# Altium schematic sheet DOAN2.SchDoc
size A3; SheetNumber: 1; SheetTotal: 2
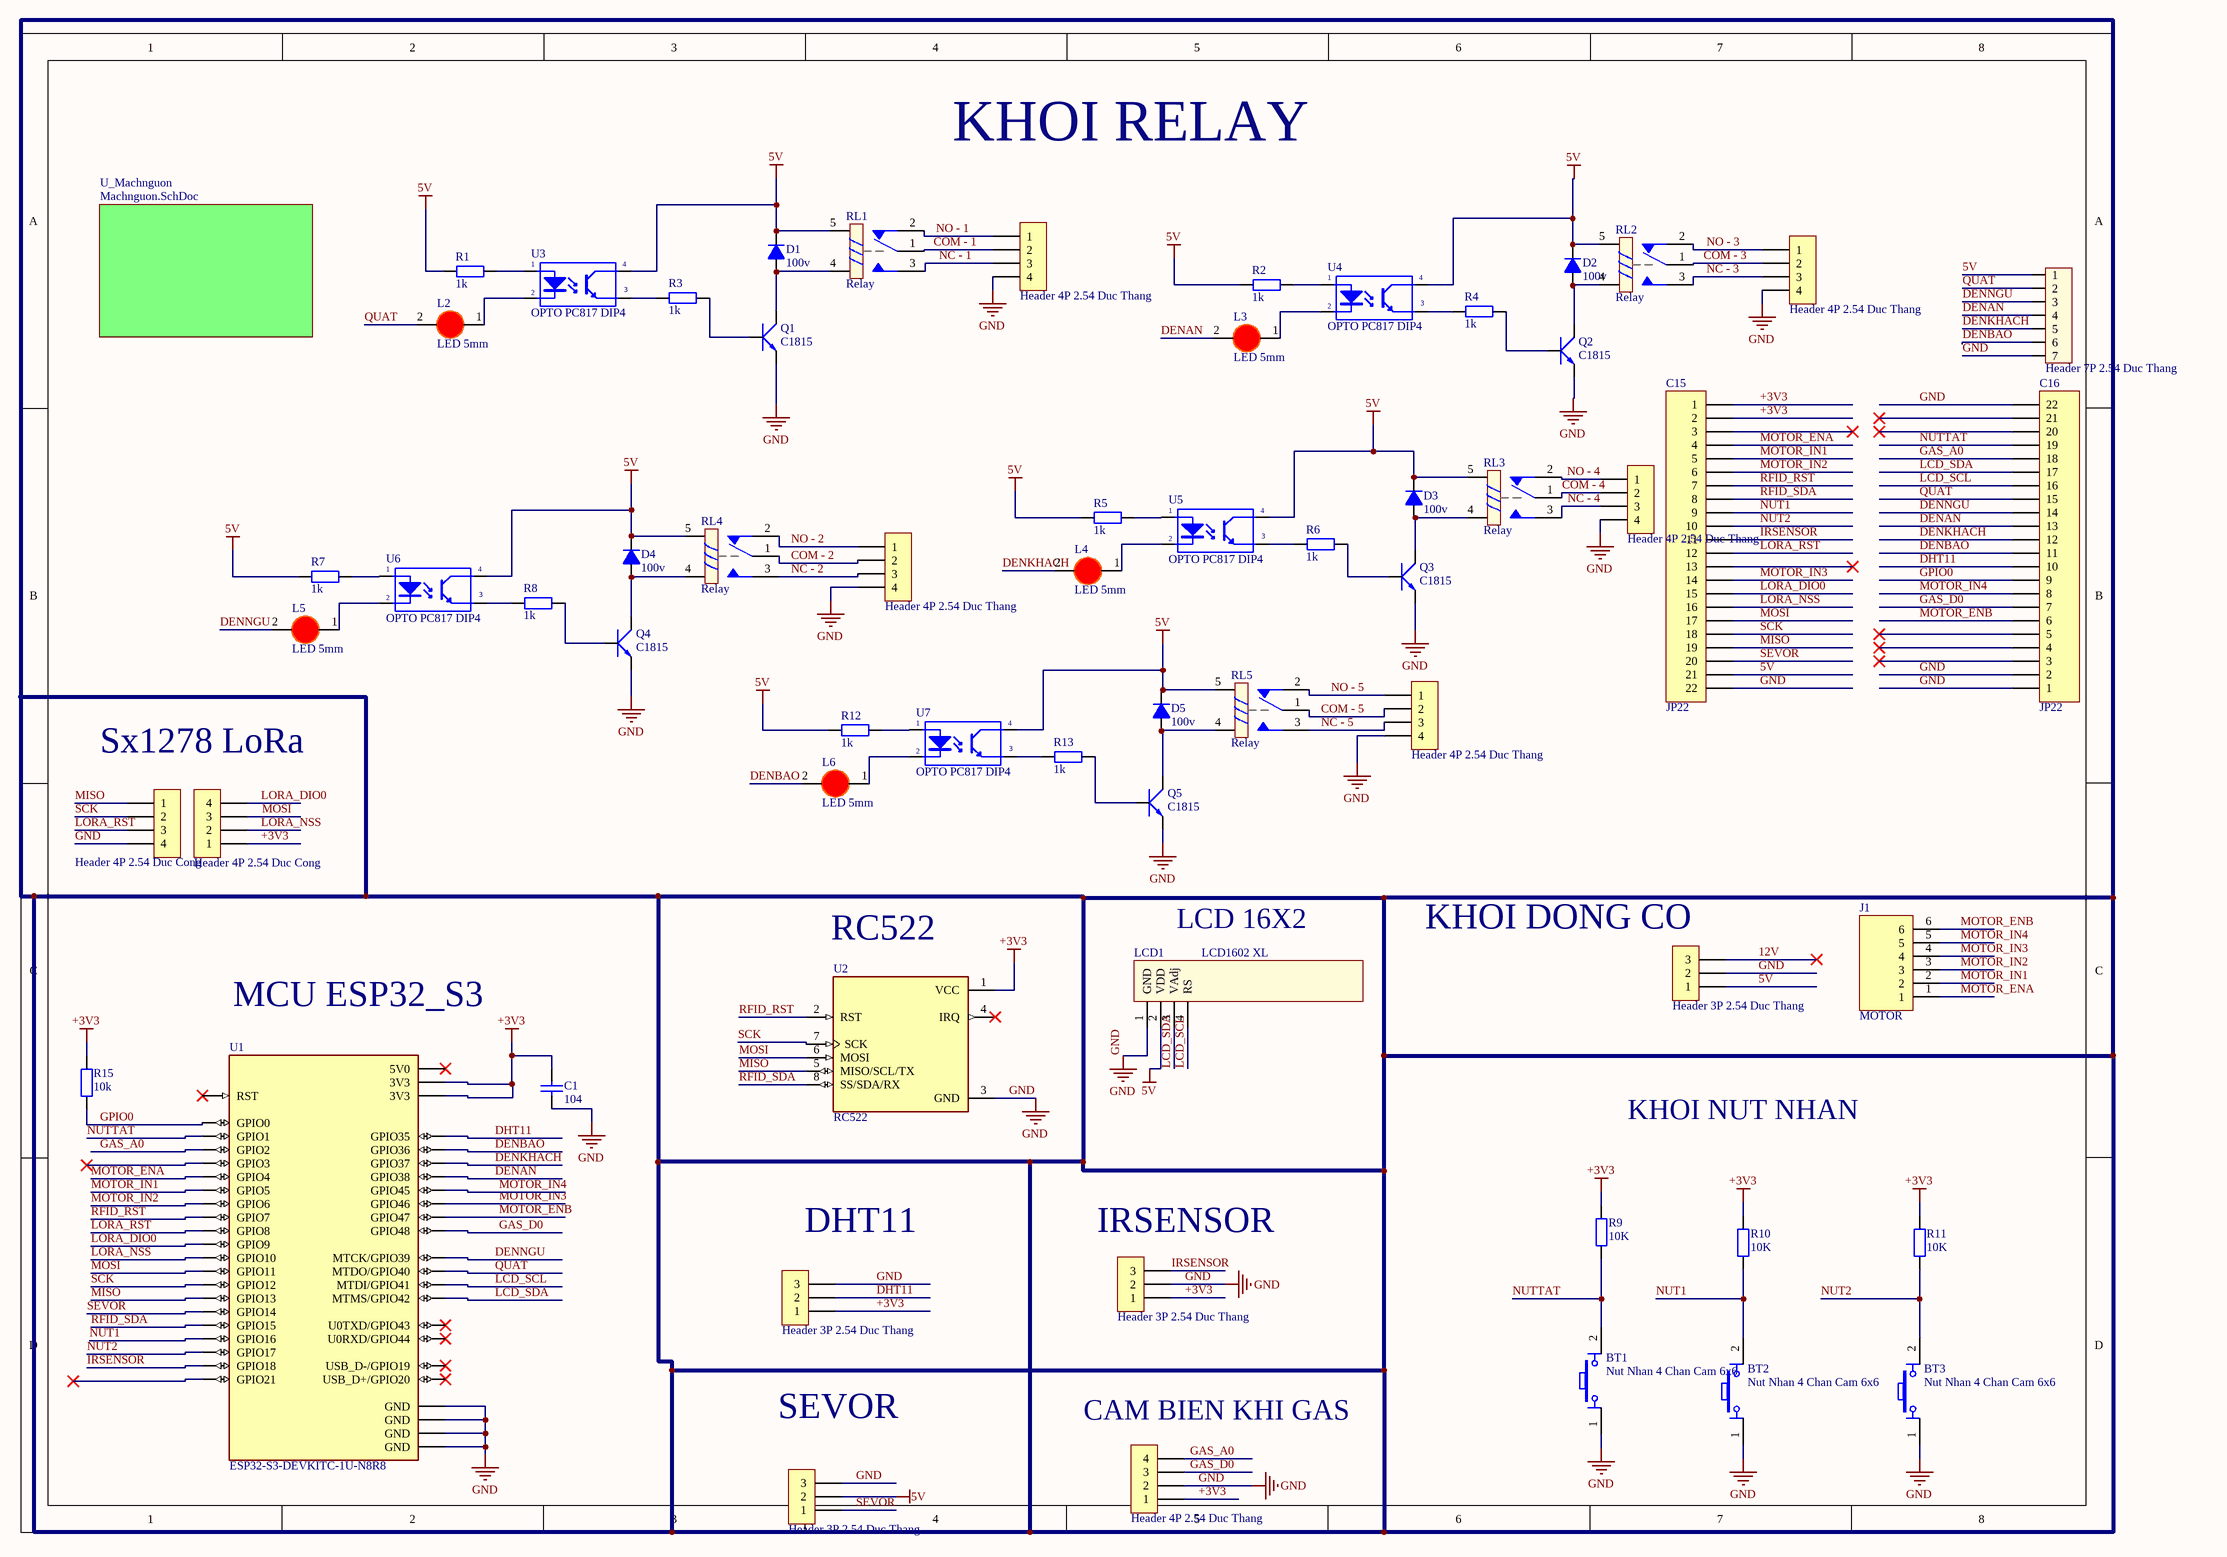
[diagram p0: DOAN2.SchDoc]

## Parts
BT1  Nut Nhan 4 Chan Cam 6x6  [Nut Nhan 4 Chan Cam 6x6]
BT2  Nut Nhan 4 Chan Cam 6x6  [Nut Nhan 4 Chan Cam 6x6]
BT3  Nut Nhan 4 Chan Cam 6x6  [Nut Nhan 4 Chan Cam 6x6]
C1  104  [tu gom]
C15  JP22  [JP22-D1C]
C16  JP22  [JP22-D1C]
D1  100v  [DIODE 1A]
D2  100v  [DIODE 1A]
D3  100v  [DIODE 1A]
D4  100v  [DIODE 1A]
D5  100v  [DIODE 1A]
H1  Header 7P 2.54 Duc Thang  [XH2.54M-7]
H2  Header 4P 2.54 Duc Thang  [XH2.54M-4]
H3  Header 4P 2.54 Duc Thang  [XH2.54M-4]
H4  Header 4P 2.54 Duc Thang  [XH2.54M-4]
H5  Header 4P 2.54 Duc Thang  [XH2.54M-4]
H6  Header 4P 2.54 Duc Thang  [XH2.54M-4]
H7  Header 4P 2.54 Duc Cong  [Header 4P DC 2.54]
H8  Header 3P 2.54 Duc Thang  [XH2.54M-3]
H9  Header 3P 2.54 Duc Thang  [XH2.54M-3]
H10  Header 3P 2.54 Duc Thang  [XH2.54M-3]
H11  Header 4P 2.54 Duc Thang  [XH2.54M-4]
H12  Header 3P 2.54 Duc Thang  [XH2.54M-3]
H13  Header 4P 2.54 Duc Cong  [Header 4P DC 2.54]
J1  MOTOR  [CON6_100_S6B-XH-A_TH_RA]
L2  LED 5mm  [LED-5MM-RED]
L3  LED 5mm  [LED-5MM-RED]
L4  LED 5mm  [LED-5MM-RED]
L5  LED 5mm  [LED-5MM-RED]
L6  LED 5mm  [LED-5MM-RED]
LCD1  LCD1602 XL  [LCD1602 with Jump]
Q1  C1815  [TO92]
Q2  C1815  [TO92]
Q3  C1815  [TO92]
Q4  C1815  [TO92]
Q5  C1815  [TO92]
R1  1k  [tro vach 1/4w]
R2  1k  [tro vach 1/4w]
R3  1k  [tro vach 1/4w]
R4  1k  [tro vach 1/4w]
R5  1k  [tro vach 1/4w]
R6  1k  [tro vach 1/4w]
R7  1k  [tro vach 1/4w]
R8  1k  [tro vach 1/4w]
R9  10K  [tro vach 1/4w]
R10  10K  [tro vach 1/4w]
R11  10K  [tro vach 1/4w]
R12  1k  [tro vach 1/4w]
R13  1k  [tro vach 1/4w]
R15  10k  [tro vach 1/4w]
RL1  Relay  [Relay 5 Chan SRD]
RL2  Relay  [Relay 5 Chan SRD]
RL3  Relay  [Relay 5 Chan SRD]
RL4  Relay  [Relay 5 Chan SRD]
RL5  Relay  [Relay 5 Chan SRD]
U1  ESP32-S3-DEVKITC-1U-N8R8  [MODULE_ESP32-S3-DEVKITC-1U-N8R8]
U2  RC522  [MODULE_CEG006900]
U3  OPTO PC817 DIP4  [DIP4]
U4  OPTO PC817 DIP4  [DIP4]
U5  OPTO PC817 DIP4  [DIP4]
U6  OPTO PC817 DIP4  [DIP4]
U7  OPTO PC817 DIP4  [DIP4]

## Sub-sheets
U_Machnguon = Machnguon.SchDoc: no entries

## Nets
5V: C15.21 D1.2(K) D2.2(K) D3.2(K) D4.2(K) D5.2(K) H1.1 H8.1 H12.2 LCD1.2(VDD) R1.1 R2.1 R5.1 R7.1 R12.1 RL1.5 RL2.5 RL3.5 RL4.5 RL5.5 U3.4(C) U4.4(C) U5.4(C) U6.4(C) U7.4(C)
+3V3: C1.1 C15.1 C15.2 H9.1 H10.1 H11.1 H13.1 R9.1 R10.1 R11.1 R15.2 U1.VCC(3V3) U2.1(VCC)
GND: BT1.1 BT2.1 BT3.1 C1.2 C15.22 C16.1 C16.2 C16.22 H1.7 H2.4 H3.4 H4.4 H5.4 H6.4 H7.4 H8.2 H9.2 H10.3 H11.2 H12.3 LCD1.1(GND) Q1.1(E) Q2.1(E) Q3.1(E) Q4.1(E) Q5.1(E) U1.GND U2.3(GND)
12V: H8.3
COM - 1: H2.2 RL1.1
COM - 2: H5.2 RL4.1
COM - 3: H3.2 RL2.1
COM - 4: H4.2 RL3.1
COM - 5: H6.2 RL5.1
DENAN: C16.13 H1.4 L3.2(K) U1.J3_10(GPIO38)
DENBAO: C16.11 H1.6 L6.2(K) U1.J3_12(GPIO36)
DENKHACH: C16.12 H1.5 L4.2(K) U1.J3_11(GPIO37)
DENNGU: C16.14 H1.3 L5.2(K) U1.J3_9(MTCK/GPIO39)
DHT11: C16.10 H10.2 U1.J3_13(GPIO35)
GAS_A0: C16.18 H11.4 U1.J3_5(GPIO2)
GAS_D0: C16.7 H11.3 U1.J3_16(GPIO48)
GPIO0: C16.9 R15.1 U1.J3_14(GPIO0)
IRSENSOR: C15.11 H9.3 U1.J1_11(GPIO18)
LCD_SCL: C16.16 LCD1.4(RS) U1.J3_7(MTDI/GPIO41)
LCD_SDA: C16.17 LCD1.3(VAdj) U1.J3_6(MTMS/GPIO42)
LORA_DIO0: C15.15 H13.4 U1.J1_15(GPIO9)
LORA_NSS: C15.16 H13.2 U1.J1_16(GPIO10)
LORA_RST: C15.12 H7.3 U1.J1_12(GPIO8)
MISO: C15.19 H7.1 U1.J1_19(GPIO13) U2.5(MISO/SCL/TX)
MOSI: C15.17 H13.3 U1.J1_17(GPIO11) U2.6(MOSI)
MOTOR_ENA: C15.4 J1.1 U1.J1_4(GPIO4)
MOTOR_ENB: C16.6 J1.6 U1.J3_17(GPIO47)
MOTOR_IN1: C15.5 J1.2 U1.J1_5(GPIO5)
MOTOR_IN2: C15.6 J1.3 U1.J1_6(GPIO6)
MOTOR_IN3: C15.14 J1.4 U1.J1_14(GPIO46)
MOTOR_IN4: C16.8 J1.5 U1.J3_15(GPIO45)
NC - 1: H2.3 RL1.3
NC - 2: H5.3 RL4.3
NC - 3: H3.3 RL2.3
NC - 4: H4.3 RL3.3
NC - 5: H6.3 RL5.3
NO - 1: H2.1 RL1.2
NO - 2: H5.1 RL4.2
NO - 3: H3.1 RL2.2
NO - 4: H4.1 RL3.2
NO - 5: H6.1 RL5.2
NUT1: BT2.2 C15.9 R10.2 U1.J1_9(GPIO16)
NUT2: BT3.2 C15.10 R11.2 U1.J1_10(GPIO17)
NUTTAT: BT1.2 C16.19 R9.2 U1.J3_4(GPIO1)
QUAT: C16.15 H1.2 L2.2(K) U1.J3_8(MTDO/GPIO40)
RFID_RST: C15.7 U1.J1_7(GPIO7) U2.2(RST)
RFID_SDA: C15.8 U1.J1_8(GPIO15) U2.8(SS/SDA/RX)
SCK: C15.18 H7.2 U1.J1_18(GPIO12) U2.7(SCK)
SEVOR: C15.20 H12.1 U1.J1_20(GPIO14)
NetD1_1: D1.1(A) Q1.2(C) RL1.4
NetD2_1: D2.1(A) Q2.2(C) RL2.4
NetD3_1: D3.1(A) Q3.2(C) RL3.4
NetD4_1: D4.1(A) Q4.2(C) RL4.4
NetD5_1: D5.1(A) Q5.2(C) RL5.4
NetL2_1: L2.1(A) U3.2(K)
NetL3_1: L3.1(A) U4.2(K)
NetL4_1: L4.1(A) U5.2(K)
NetL5_1: L5.1(A) U6.2(K)
NetL6_1: L6.1(A) U7.2(K)
NetQ1_3: Q1.3(B) R3.2
NetQ2_3: Q2.3(B) R4.2
NetQ3_3: Q3.3(B) R6.2
NetQ4_3: Q4.3(B) R8.2
NetQ5_3: Q5.3(B) R13.2
NetR1_2: R1.2 U3.1(A)
NetR2_2: R2.2 U4.1(A)
NetR3_1: R3.1 U3.3(E)
NetR4_1: R4.1 U4.3(E)
NetR5_2: R5.2 U5.1(A)
NetR6_1: R6.1 U5.3(E)
NetR7_2: R7.2 U6.1(A)
NetR8_1: R8.1 U6.3(E)
NetR12_2: R12.2 U7.1(A)
NetR13_1: R13.1 U7.3(E)

Not connected (* = marked no-connect by the designer): C15 3* 13*; C16 3* 4* 5* 20* 21*; U1 5V(5V0)* J1_3(RST)* J1_13(GPIO3)* J3_2(U0TXD/GPIO43)* J3_3(U0RXD/GPIO44)* J3_18(GPIO21)* J3_19(USB_D+/GPIO20)* J3_20(USB_D-/GPIO19)*; U2 4(IRQ)*

## Notes on the sheet
- KHOI RELAY
- Sx1278 LoRa
- (near U2) RC522
- LCD 16X2
- KHOI DONG CO
- (near U1) MCU ESP32_S3
- KHOI NUT NHAN
- (near H10) DHT11
- (near H9) IRSENSOR
- SEVOR
- (near H11) CAM BIEN KHI GAS
- Title
- Size:
- Date:
- File:
- A1
- Number:
- Time:
- Revision:
- Sheet
- of

## Library data of the parts
BT1-BT3 = Nut Nhan 4 Chan Cam 6x6: Nut Nhan 4 Chan 6x6mm; Ten: Nút Nhấn 4 Chân 6x6x5MM DIP; Ma_Hang: MH004584
C1 = Tu gom 104 50V: Cắm; So_Chan: 2; Ten_Linh_Kien: Tụ gốm 104 100nF 50V; Don_Vi: Con; Ma_Hang: MH004761; Chung_Loai: Cắm; Kieu_Chan: *
C15 C16 = JP22: WR-PHD 2.54 mm Angled Socket Header; Manufacturer: W¨¹rth Elektronik eiSos GmbH; partNo: 613022143121; ComponentLink1 Description: Manufacturer; ComponentLink2 Description: Datasheet; NoPins: 22; Created Date: 29 March 2013; ComponentLink1URL: http://www.we-online.com; ComponentLink2URL: http://katalog.we-online.de/em/datasheet/6130xx143121.pdf; Created by: Karrer Zheng
D1-D5 = Diode 1N4007: Cắm; Ten_Linh_Kien: Diode 1N4007 1A (DIP); Don_Vi: Con; Ma_Hang: MH001063; Ghi Chu: *; Kieu_Chan: *; Chung_Loai: Cắm
H1 = Header 7P 2.54 Duc Thang: Cắm; Ten_Linh_Kien: Header 7P XH2.54-7P Đực Thẳng; Don_Vi: Con; Ma_Hang: MH003369; Chung_Loai: Cắm
H2-H6 H11 = Header 4P 2.54 Duc Thang: Cắm; Ten_Linh_Kien: Header 4P XH2.54-4P Đực Thẳng; Don_Vi: Con; Ma_Hang: MH001285; Chung_Loai: Cắm
H7 H13 = Header 4P 2.54 Duc Cong: Cắm; Ten_Linh_Kien: Header 4P XH2.54-4P Đực Cong; Don_Vi: Con; Ma_Hang: MH001310; Chung_Loai: Cắm
H8-H10 H12 = Header 3P 2.54 Duc Thang: Cắm; Ten_Linh_Kien: Header 3P XH2.54-3P Đực Thẳng; Don_Vi: Con; Ma_Hang: MH001292; Chung_Loai: Cắm
J1 = CON-PLG_6X1-100-RA-TH: 6 Pins, 1 Row 2.54mm Pitch, right angle Connector, male; Manufacturer: JST; Manufacturer Part Number: S6B-XH-A(LF)(SN); Mating Part Number: XHP-6; Crimp Part Number: ASXHSXH22K51; Alternate Part Number-1: NA; Case/Package: TH-CON; Supplier-1: ARROW; Supplier Part Number-1: S6B-XH-A(LF)(SN)
L2-L6 = LED 5mm Do: Cắm; Don_Vi: Con; Ma_Hang: MH008967; Ten_Linh_Kien: Led 5MM Phủ Đỏ (1000c); Ghi_Chu: *; Kieu_Chan: *; Chung_Loai: Cắm
LCD1 = LCD1602 XL: LCD 1602 Xanh Lá; Ten: Màn hình LCD 1602 Xanh Lá; Ma_Hang: 67HZ; NCC: NSHOP; CHIP: HD44780
Q1-Q5 = Trans C1815 DIP: NPN transistor; Value: C9014
R1-R8 R12 R13 = Tro Vach 1/4W 5% 1k: Cắm; Don_Vi: Con; So_Chan: 2; Ten_Linh_Kien: Trở Vạch 1/4w 5% 1k; Ma_Hang: MH007390; Chung_Loai: Cắm; Kieu_Chan: *
R9-R11 = Tro Vach 1/4W 1% 360R: Cắm; Don_Vi: Con; So_Chan: 2; Ten_Linh_Kien: Trở Vạch 1/4W 1% 360R; Ma_Hang: MH008835; Chung_Loai: Cắm; Kieu_Chan: *
R15 = Tro Vach 1/4W 5% 10k: Căm; Chung_Loai: Cắm; Don_Vi: Con; So_Chan: 2; Ten_Linh_Kien: Trở Vạch 1/4w 5% 10K; Ma_Hang: MH007354; Kieu_Chan: *
RL1-RL5 = Relay 5 Chan SRD: Relay 5 Chan; Ma_Hang: MH009374; Ten: Relay 5V10A SRD-05VDC-SL-C Chính Hãng
U1 = ESP32-S3-DEVKITC-1U-N8R8: The ESP32-S3-DEVKITC-1U-N8R8 from Espressif Systems is an evaluation board designed for wireless communication applications. It features a 32-bit Xtensa dual-core processor running at 240MHz, providing strong processing power for complex tasks. The board; SnapEDA_Link: https://www.snapeda.com/parts/ESP32-S3-DEVKITC-1U-N8R8/Espressif+Systems/view-part/?ref=snap; Package: None; Value: *; MF: Espressif Systems; MP: ESP32-S3-DEVKITC-1U-N8R8; Check_prices: https://www.snapeda.com/parts/ESP32-S3-DEVKITC-1U-N8R8/Espressif+Systems/view-part/?ref=eda
U2 = CEG006900: RFID RC522 Reader IC Card Module Tags SPI Interface Read and Write; MF: YKS; Value: *; SnapEDA_Link: https://www.snapeda.com/parts/CEG006900/YKS/view-part/?ref=snap; MP: CEG006900; Check_prices: https://www.snapeda.com/parts/CEG006900/YKS/view-part/?ref=eda; Availability: Not in stock; Price: None; Package: None
U3-U7 = OPTO PC817 DIP4: Single Opto; Value: PC817